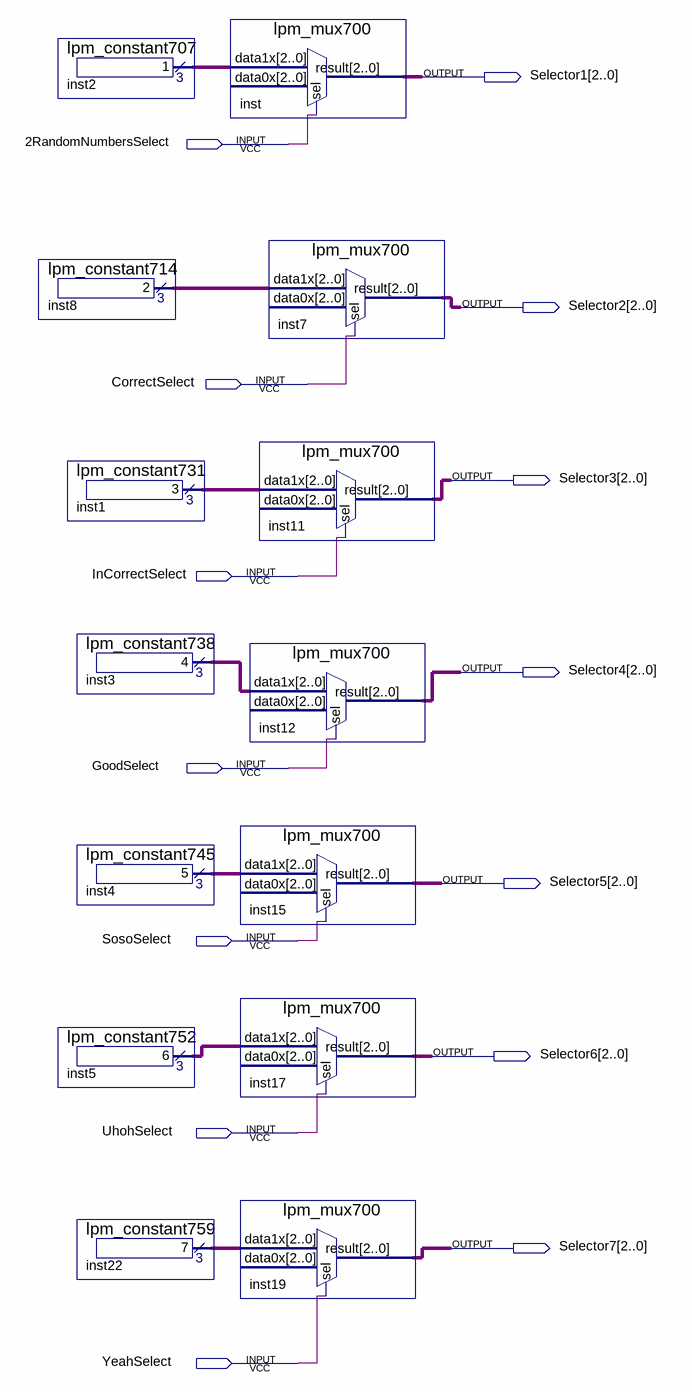
[diagram p0: schematic sheet]
// Quartus schematic DisplaySelector.bdf as structural Verilog: 14 symbols, 14 pins
module DisplaySelector (
  input  \2RandomNumbersSelect ,
  input  CorrectSelect,
  input  InCorrectSelect,
  input  GoodSelect,
  input  SosoSelect,
  input  UhohSelect,
  input  YeahSelect,
  output [2:0] Selector1,
  output [2:0] Selector2,
  output [2:0] Selector3,
  output [2:0] Selector4,
  output [2:0] Selector5,
  output [2:0] Selector6,
  output [2:0] Selector7
);

  wire [2:0] inst1_result, inst2_result, inst3_result, inst4_result, inst5_result, inst8_result,
       inst22_result;

  lpm_constant707 inst2 (.result(inst2_result));
  lpm_constant714 inst8 (.result(inst8_result));
  lpm_constant731 inst1 (.result(inst1_result));
  lpm_constant738 inst3 (.result(inst3_result));
  lpm_constant745 inst4 (.result(inst4_result));
  lpm_constant752 inst5 (.result(inst5_result));
  lpm_constant759 inst22 (.result(inst22_result));
  lpm_mux700 inst (.data1x(inst2_result), .sel(\2RandomNumbersSelect ), .result(Selector1));  // open: data0x
  lpm_mux700 inst12 (.data1x(inst3_result), .sel(GoodSelect), .result(Selector4));  // open: data0x
  lpm_mux700 inst15 (.data1x(inst4_result), .sel(SosoSelect), .result(Selector5));  // open: data0x
  lpm_mux700 inst17 (.data1x(inst5_result), .sel(UhohSelect), .result(Selector6));  // open: data0x
  lpm_mux700 inst19 (.data1x(inst22_result), .sel(YeahSelect), .result(Selector7));  // open: data0x
  lpm_mux700 inst7 (.data1x(inst8_result), .sel(CorrectSelect), .result(Selector2));  // open: data0x
  lpm_mux700 inst11 (.data1x(inst1_result), .sel(InCorrectSelect), .result(Selector3));  // open: data0x
endmodule
